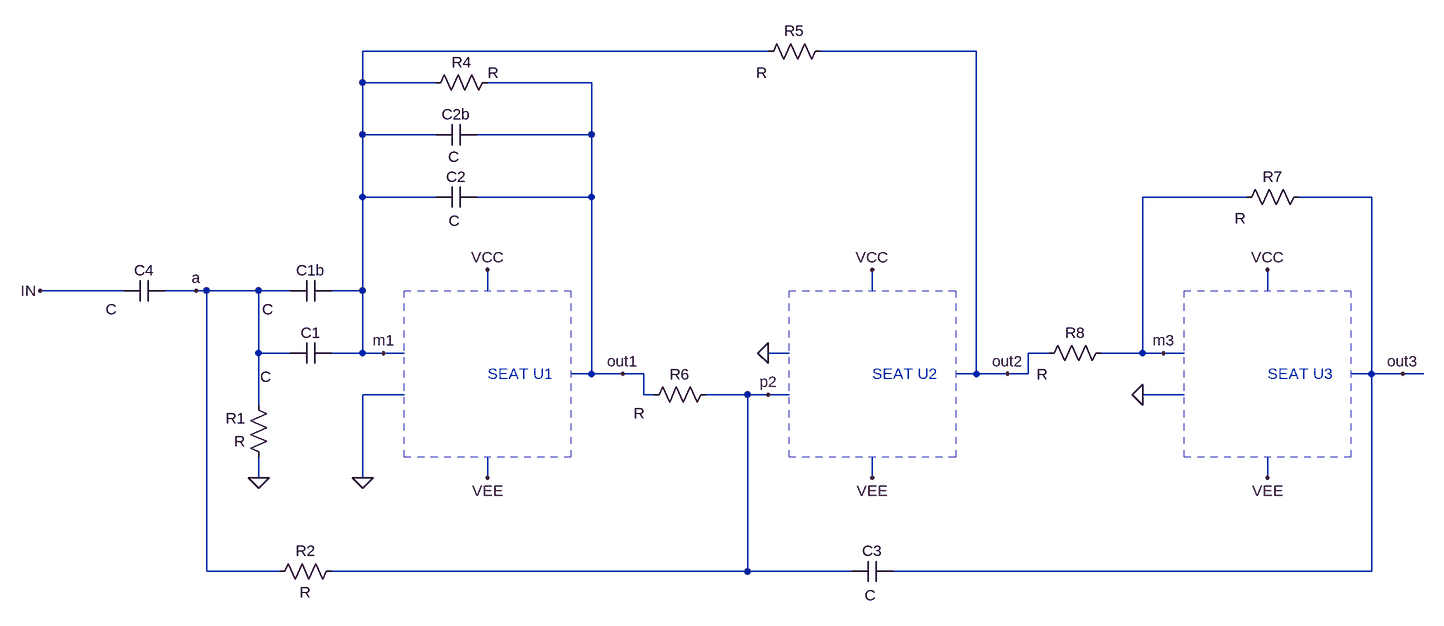
[diagram p0: schematic AM_HPn.asc]
AM_HPn.asc, the LTspice schematic file:
Version 4.1
SHEET 1 2172 680
WIRE 1104 -288 480 -288
WIRE 1424 -288 1184 -288
WIRE 480 -240 480 -288
WIRE 592 -240 480 -240
WIRE 832 -240 672 -240
WIRE 480 -160 480 -240
WIRE 592 -160 480 -160
WIRE 832 -160 832 -240
WIRE 832 -160 656 -160
WIRE 480 -64 480 -160
WIRE 592 -64 480 -64
WIRE 832 -64 832 -160
WIRE 832 -64 656 -64
WIRE 1840 -64 1680 -64
WIRE 2032 -64 1920 -64
WIRE 112 80 -16 80
WIRE 224 80 176 80
WIRE 240 80 224 80
WIRE 320 80 240 80
WIRE 368 80 320 80
WIRE 480 80 480 -64
WIRE 480 80 432 80
WIRE 672 80 672 48
WIRE 1264 80 1264 48
WIRE 1872 80 1872 48
WIRE 320 176 320 80
WIRE 368 176 320 176
WIRE 480 176 480 80
WIRE 480 176 432 176
WIRE 512 176 480 176
WIRE 544 176 512 176
WIRE 1136 176 1104 176
WIRE 1536 176 1504 176
WIRE 1680 176 1680 -64
WIRE 1680 176 1616 176
WIRE 1712 176 1680 176
WIRE 1744 176 1712 176
WIRE 832 208 832 -64
WIRE 832 208 800 208
WIRE 880 208 832 208
WIRE 912 208 880 208
WIRE 1424 208 1424 -288
WIRE 1424 208 1392 208
WIRE 1472 208 1424 208
WIRE 1504 208 1504 176
WIRE 1504 208 1472 208
WIRE 2032 208 2032 -64
WIRE 2032 208 2000 208
WIRE 2080 208 2032 208
WIRE 2112 208 2080 208
WIRE 544 240 480 240
WIRE 912 240 912 208
WIRE 928 240 912 240
WIRE 1072 240 1008 240
WIRE 1104 240 1072 240
WIRE 1136 240 1104 240
WIRE 1744 240 1680 240
WIRE 320 256 320 176
WIRE 320 368 320 336
WIRE 480 368 480 240
WIRE 672 368 672 336
WIRE 1264 368 1264 336
WIRE 1872 368 1872 336
WIRE 240 512 240 80
WIRE 352 512 240 512
WIRE 1072 512 1072 240
WIRE 1072 512 432 512
WIRE 1232 512 1072 512
WIRE 2032 512 2032 208
WIRE 2032 512 1296 512
FLAG 672 48 VCC
FLAG 672 368 VEE
FLAG 512 176 m1
FLAG 224 80 a
FLAG 480 368 0
FLAG 880 208 out1
FLAG 320 368 0
FLAG 1264 48 VCC
FLAG 1264 368 VEE
FLAG 1104 176 0
FLAG 1472 208 out2
FLAG 1104 240 p2
FLAG 1872 48 VCC
FLAG 1872 368 VEE
FLAG 1680 240 0
FLAG 2080 208 out3
FLAG 1712 176 m3
FLAG -16 80 IN
SYMBOL res 336 352 R180
WINDOW 0 36 76 Left 2
WINDOW 3 36 40 Left 2
SYMATTR InstName R1
SYMBOL res 448 496 R90
WINDOW 0 0 56 VBottom 2
WINDOW 3 32 56 VTop 2
SYMATTR InstName R2
SYMBOL cap 432 64 R90
WINDOW 3 29 98 VTop 2
WINDOW 0 0 32 VBottom 2
SYMATTR InstName C1b
SYMBOL cap 432 160 R90
WINDOW 0 0 32 VBottom 2
WINDOW 3 37 101 VTop 2
SYMATTR InstName C1
SYMBOL cap 176 64 R90
WINDOW 0 0 32 VBottom 2
WINDOW 3 29 83 VTop 2
SYMATTR InstName C4
SYMBOL res 1024 224 R90
WINDOW 0 0 56 VBottom 2
WINDOW 3 29 118 VTop 2
SYMATTR InstName R6
SYMBOL cap 656 -176 R90
WINDOW 3 34 36 VTop 2
WINDOW 0 0 32 VBottom 2
SYMATTR InstName C2b
SYMBOL cap 656 -80 R90
WINDOW 0 0 32 VBottom 2
WINDOW 3 37 35 VTop 2
SYMATTR InstName C2
SYMBOL res 688 -256 R90
WINDOW 0 0 56 VBottom 2
WINDOW 3 -15 7 VTop 2
SYMATTR InstName R4
SYMBOL res 1200 -304 R90
WINDOW 0 0 56 VBottom 2
WINDOW 3 33 106 VTop 2
SYMATTR InstName R5
SYMBOL res 1632 160 R90
WINDOW 0 0 56 VBottom 2
WINDOW 3 33 106 VTop 2
SYMATTR InstName R8
SYMBOL res 1936 -80 R90
WINDOW 0 0 56 VBottom 2
WINDOW 3 33 106 VTop 2
SYMATTR InstName R7
SYMBOL cap 1296 496 R90
WINDOW 0 0 32 VBottom 2
WINDOW 3 37 35 VTop 2
SYMATTR InstName C3
TEXT 672 208 Left 2 ;SEAT U1
TEXT 1264 208 Left 2 ;SEAT U2
TEXT 1872 208 Left 2 ;SEAT U3
RECTANGLE Normal 544 80 800 336 2
RECTANGLE Normal 1136 80 1392 336 2
RECTANGLE Normal 1744 80 2000 336 2

The netlist it stands for:
* AM_HPn.asc
R1 0 a R
R2 p2 a R
C1b m1 a C
C1 m1 a C
C4 a IN C
R6 p2 out1 R
C2b out1 m1 C
C2 out1 m1 C
R4 out1 m1 R
R5 out2 m1 R
R8 m3 out2 R
R7 out3 m3 R
C3 out3 p2 C
* SEAT U1
* SEAT U2
* SEAT U3
.backanno
.end